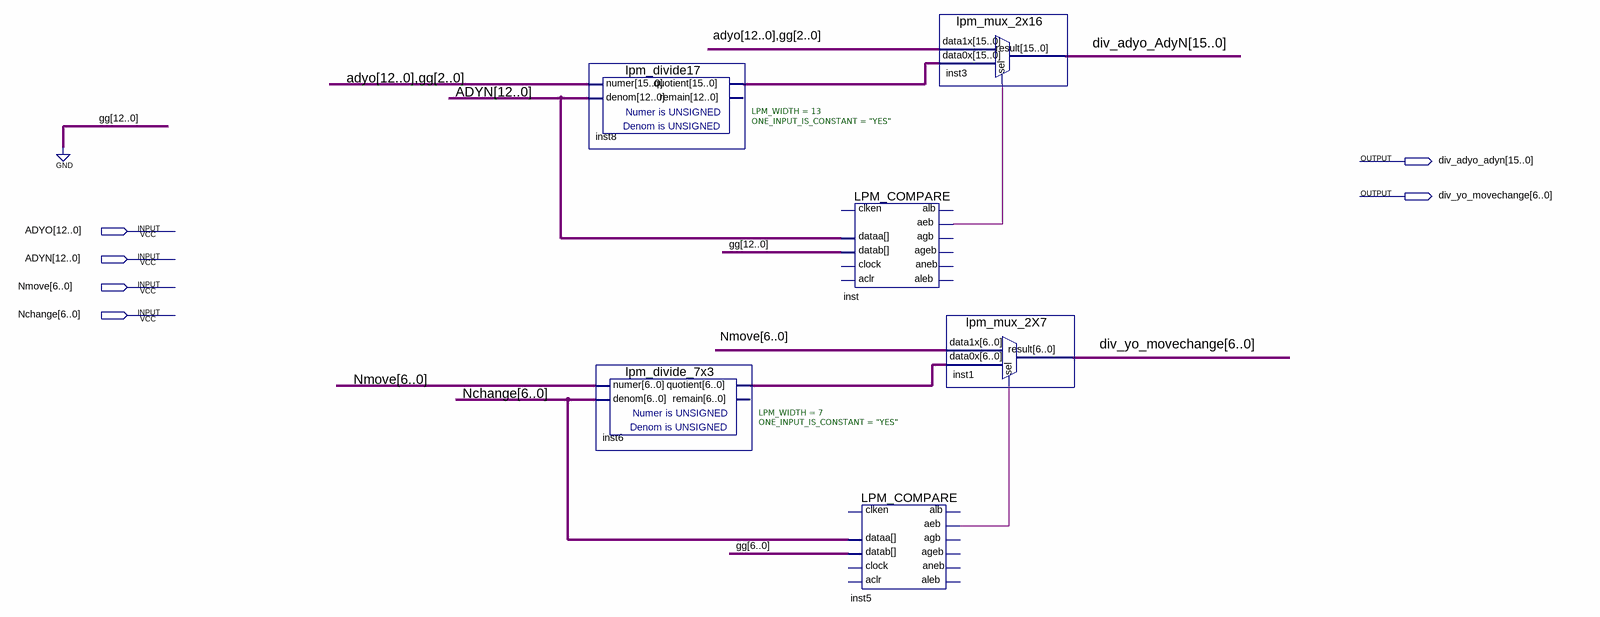
[diagram p0: schematic sheet]
// Quartus schematic htpa_preDIVIDER.bdf as structural Verilog: 6 symbols, 6 pins
module htpa_preDIVIDER (
  input  [12:0] ADYO,
  input  [12:0] ADYN,
  input  [6:0] Nmove,
  input  [6:0] Nchange,
  output [15:0] div_adyo_adyn,
  output [6:0] div_yo_movechange
);

  wire inst5_aeb, inst_aeb;
  wire [6:0] inst6_quotient;
  wire [15:0] inst8_quotient;

  lpm_divide17 inst8 (.numer({ADYO, 3'b000}), .denom(ADYN), .quotient(inst8_quotient));  // open: remain
  lpm_divide_7x3 inst6 (.numer(Nmove), .denom(Nchange), .quotient(inst6_quotient));  // open: remain
  LPM_COMPARE #(.LPM_WIDTH(13), .ONE_INPUT_IS_CONSTANT("YES")) inst (
    .dataa(ADYN), .datab({13{1'b0}}), .aeb(inst_aeb));  // open: clock, aclr, clken, aleb, agb, aneb, ageb, alb
  LPM_COMPARE #(.LPM_WIDTH(7), .ONE_INPUT_IS_CONSTANT("YES")) inst5 (
    .dataa(Nchange), .datab({7{1'b0}}), .aeb(inst5_aeb));  // open: clock, aclr, clken, aleb, agb, aneb, ageb, alb
  lpm_mux_2x16 inst3 (.data1x({ADYO, 3'b000}), .data0x(inst8_quotient), .sel(inst_aeb), .result(div_adyo_adyn));
  lpm_mux_2X7 inst1 (.data1x(Nmove), .data0x(inst6_quotient), .sel(inst5_aeb), .result(div_yo_movechange));
endmodule
